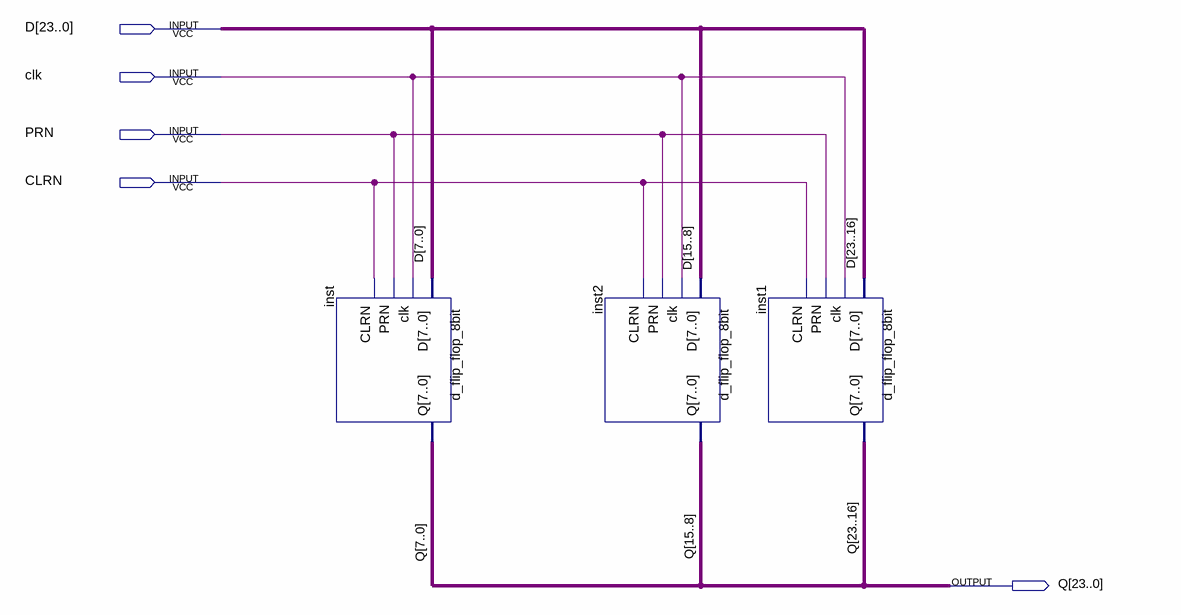
[diagram p0: schematic sheet]
// Quartus schematic d_flip_flop_24bit.bdf as structural Verilog: 3 symbols, 5 pins
module d_flip_flop_24bit (
  input  [23:0] D,
  input  clk,
  input  PRN,
  input  CLRN,
  output [23:0] Q
);

  d_flip_flop_8bit inst (.D(D[7:0]), .clk(clk), .PRN(PRN), .CLRN(CLRN), .Q(Q[7:0]));
  d_flip_flop_8bit inst2 (.D(D[15:8]), .clk(clk), .PRN(PRN), .CLRN(CLRN), .Q(Q[15:8]));
  d_flip_flop_8bit inst1 (.D(D[23:16]), .clk(clk), .PRN(PRN), .CLRN(CLRN), .Q(Q[23:16]));
endmodule
